# Altium schematic sheet management-i2c.SchDoc
size A3
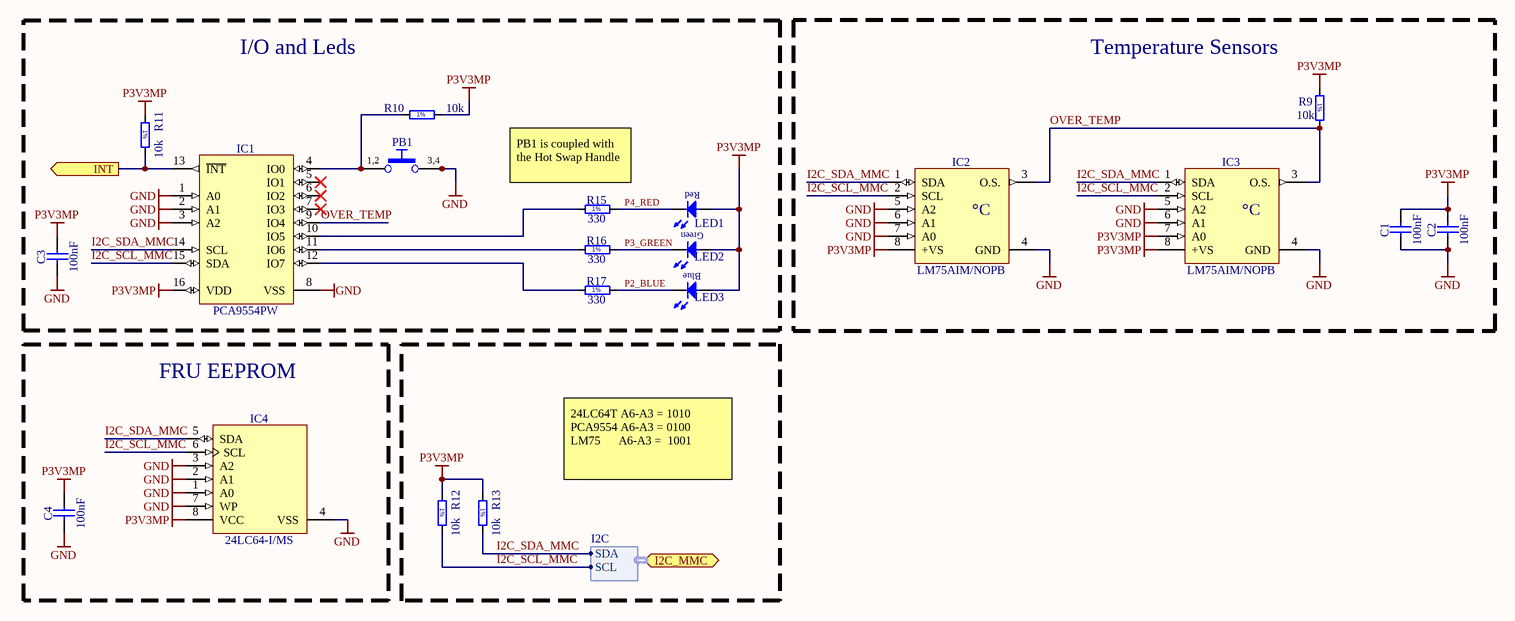
[diagram p0: management-i2c.SchDoc]

## Parts
C1  100nF  [CAPC1005X55N]
C2  100nF  [CAPC1005X55N]
C3  100nF  [CAPC1005X55N]
C4  100nF  [CAPC1005X55N]
IC1  PCA9554PW  [SOP65P640X110-16N]
IC2  LM75AIM/NOPB  [SOIC127P600X175-8N]
IC3  LM75AIM/NOPB  [SOIC127P600X175-8N]
IC4  24LC64-I/MS  [SOP65P490X110-8N]
LED1  Red  [LEDC1608X80N_RED]  (value not drawn)
LED2  Green  [LED_AVAGO_HSME-C120]  (value not drawn)
LED3  Blue  [LED_AVAGO_HSMR-C120]  (value not drawn)
PB1  Push Button  [SW_C&K_HDT0001]  (value not drawn)
R9  10k  [RESC1005X40N]
R10  10k  [RESC1005X40N]
R11  10k  [RESC1005X40N]
R12  10k  [RESC1005X40N]
R13  10k  [RESC1005X40N]
R15  330  [RESC1608X55N]
R16  330  [RESC1608X55N]
R17  330  [RESC1608X55N]

## Blocks framed on the sheet
I/O and Leds: C3 IC1 LED1-LED3 PB1 R10 R11 R15-R17
Temperature Sensors: C1 C2 IC2 IC3 R9
FRU EEPROM: C4 IC4

## Ports
I2C_MMC (bidir, harness I2C), INT (out)

## Harnesses
I2C: SDA, SCL

## Nets
GND: C1.2 C2.2 C3.2 C4.2 IC1.1(A0) IC1.2(A1) IC1.3(A2) IC1.8(VSS) IC2.4(GND) IC2.5(A2) IC2.6(A1) IC2.7(A0) IC3.4(GND) IC3.5(A2) IC3.6(A1) IC4.1(A0) IC4.2(A1) IC4.3(A2) IC4.4(VSS) IC4.7(WP) PB1.3 PB1.4
P3V3MP: C1.1 C2.1 C3.1 C4.1 IC1.16(VDD) IC2.8(+VS) IC3.7(A0) IC3.8(+VS) IC4.8(VCC) LED1.2(A) LED2.2(A) LED3.2(A) R9.1 R10.2 R11.1 R12.1 R13.1
I2C_SCL_MMC: IC1.15(SDA) IC2.2(SCL) IC3.2(SCL) IC4.6(SCL) R12.2 ; port I2C_MMC.SCL
I2C_SDA_MMC: IC1.14(SCL) IC2.1(SDA) IC3.1(SDA) IC4.5(SDA) R13.2 ; port I2C_MMC.SDA
INT: IC1.13(~{INT}) R11.2 ; port INT
OVER_TEMP: IC1.9(IO4) IC2.3(O.S.) IC3.3(O.S.) R9.2
P2_BLUE: LED3.1(C) R17.2
P3_GREEN: LED2.1(C) R16.2
P4_RED: LED1.1(C) R15.2
NetIC1_4: IC1.4(IO0) PB1.1 PB1.2 R10.1
NetIC1_10: IC1.10(IO5) R15.1
NetIC1_11: IC1.11(IO6) R16.1
NetIC1_12: IC1.12(IO7) R17.1

Not connected (* = marked no-connect by the designer): IC1 5(IO1)* 6(IO2)* 7(IO3)*

## Notes on the sheet
- (near R15) PB1 is coupled with the Hot Swap Handle
- 24LC64T A6-A3 = 1010
  PCA9554 A6-A3 = 0100
  LM75      A6-A3 =  1001
- Title:
- Date:
- Project:
- Drawn by:
- Time:
- Revised by:
- Sheet
- of
- Grupo de diagnóstico do feixe -
  DIG - LNLS
- Copyright CNPEM 2020.
  This documentation describes Open Hardware and is licensed under the CERN OHL S v2. You may redistribute and modify this documentation under the terms of the CERN OHL S v2. (https://www.ohwr.org/cernohl). This documentation is distributed WITHOUT ANY EXPRESS OR IMPLIED WARRANTY, INCLUDING OF MERCHANTABILITY, SATISFACTORY QUALITY AND FITNESS FOR A PARTICULAR PURPOSE. Please see the CERN OHL S v2 for applicable conditions.
- File:
- (in symbol LM75AIM/NOPB) °C
- (in symbol R0402_10K_1%_0.0625W_100PPM) 1%
- (in symbol R0603_330R_1%_0.1W_100PPM) 1%
- (in symbol SW_C&K_HDT0001) 1,2; 3,4

## Library data of the parts
C1-C4 = CC0402_100NF_16V_10%_X7R: Non-polarised capacitor; Part Description: SMD Multilayer Chip Ceramic Capacitor; Manufacturer: GENERIC; Manufacturer1 Part Number: 223878715649; Voltage: 16V; TC: X7R; Tolerance: ±10%; Table: Capacitors SMD; Part Number: CC0402_100NF_16V_10%_X7R; Component Kind: Standard; Component Type: Standard; Pin Count: 2; Value: 100nF; Status: Not Recommended; Manufacturer Part Number: CC0402_100NF_16V_10%_X7R; Case: 0402; Mounted: Yes; Socket: No; SMD: Yes; Manufacturer1 Example: PHYCOMP; Manufacturer1 ComponentHeight: 0.55mm; HelpURL: \\cern.ch\dfs\Applications\Altium\Datasheets\CC0402_X7R_PHYCOMP.pdf; Author: CERN DEM JLC; CreateDate: 12/3/2007; LatestRevisionDate: 12/3/2007
IC1 = PCA9554PW: 8-Bit I2C-Bus and SMBus I/O Port with Interrupt; Manufacturer: NXP SEMICONDUCTORS; PressFit: No; Bonding: No; Part Number: PCA9554PW; Component Kind: Standard; Component Type: Standard; Device: PCA9554PW; PackageDescription: SOP, 0.65mm pitch; 16 pin, 4.40mm W X 5.00mm L X 1.10mm H body IPC Medium Density; Part Description: 8-Bit I2C-Bus and SMBus I/O Port with Interrupt; Manufacturer Part Number: PCA9554PW; Pin Count: 16; Case: TSSOP16; Mounted: Yes; Socket: No; SMD: Yes; Sense: No; ComponentHeight: 1.1mm; Author: CERN DEM JLC; HelpURL: \\cern.ch\dfs\Applications\Altium\Datasheets\PCA9554PW.pdf; CreateDate: 04/11/2014; LatestRevisionDate: 04/11/2014
IC2 IC3 = LM75AIM/NOPB: Digital Temperature Sensor and Thermal Watchdog with Two-Wire Interface; Part Description: -25° to +100°C ±2°C Digital Temperature Sensor and Thermal Watchdog with Two-Wire Interface; Manufacturer: TEXAS INSTRUMENTS; PressFit: No; Bonding: No; Part Number: LM75AIM/NOPB; Component Kind: Standard; Component Type: Standard; Device: LM75AIM/NOPB; PackageDescription: SOIC 8, Pitch 1.27mm - Body 4x5mm, IPC Medium Density; Manufacturer Part Number: LM75AIM/NOPB; Pin Count: 8; Case: SOIC8; Mounted: Yes; Socket: No; SMD: Yes; Sense: No; ComponentHeight: 1.75mm; HelpURL: \\cern.ch\dfs\Applications\Altium\Datasheets\LM75AIM-NOPB.pdf; Author: CERN DEM JLC; CreateDate: 15/10/2012; LatestRevisionDate: 15/10/2012
IC4 = 24LC64-I/MS: 64K I2C Serial EEPROM; Part Description: 2.5V-5.5V, 64K (8K x 8-bit) I2C Serial EEPROM; Manufacturer: MICROCHIP TECHNOLOGY; Table: Logic; Part Number: 24LC64-I/MS; Component Kind: Standard; Component Type: Standard; Device: 24LC64-I/MS; PackageDescription: SOP, 0.65mm pitch; 8 pin, 3.00mm W X 3.00mm L X 1.10mm H body, IPC Medium Density; Manufacturer Part Number: 24LC64-I/MS; Pin Count: 8; Case: MSOP8; Mounted: Yes; Socket: No; SMD: Yes; ComponentHeight: 1.1mm; HelpURL: \\cern.ch\dfs\Applications\Altium\Datasheets\24LC64-I-MS.pdf; Author: CERN DEM JLC; CreateDate: 2011-01-24; LatestRevisionDate: 2011-01-24
LED1 = LED_ROHM_SML-311UTT86K: LED Red 1C 2A; Part Description: Low current chip LED SML-311 Serie; Manufacturer: ROHM; PressFit: No; Bonding: No; Part Number: LED_ROHM_SML-311UTT86K; Component Kind: Standard; Component Type: Standard; Color: Red; PackageDescription: Chip Red LED, 2-Leads, Body 1.6x0.8mm, IPC Medium Density; Manufacturer Part Number: SML-311UTT86K; Pin Count: 2; Mounted: Yes; Socket: No; SMD: Yes; Sense: No; ComponentHeight: 0.8mm; HelpURL: \\cern.ch\dfs\Applications\Altium\Datasheets\LED_ROHM_SML-311UTT86K.pdf; Author: CERN DEM JLC; CreateDate: 16/03/2010; LatestRevisionDate: 17/03/2010
LED2 = LED_AVAGO_HSME-C120: LED Green 1C 2A; Part Description: High Performance Right Angle Chip Green LED; Manufacturer: AVAGO TECHNOLOGIES; PressFit: No; Bonding: No; Part Number: LED_AVAGO_HSME-C120; Component Kind: Standard; Component Type: Standard; Color: Green; PackageDescription: Green Chip LED, 2-Leads, Body 1.7x1.1mm, Side Emitting Package; Manufacturer Part Number: HSME-C120; Pin Count: 2; Mounted: Yes; Socket: No; SMD: Yes; Sense: No; ComponentHeight: 0.7mm; HelpURL: \\cern.ch\dfs\Applications\Altium\Datasheets\LED_AVAGO_HSME-C120.pdf; ComponentLink1URL: \\cern.ch\dfs\Applications\Altium\Datasheets\LED_AVAGO_HSME-C110_DESIGN-GUIDE.pdf; ComponentLink1Description: Design Guide; Author: CERN DEM JMW; CreateDate: 22/07/2009; LatestRevisionDate: 20/06/2012
LED3 = LED_AVAGO_HSMR-C120: LED Blue 1C 2A; Part Description: High Performance Right Angle Chip InGaN Blue LED; Manufacturer: AVAGO TECHNOLOGIES; PressFit: No; Bonding: No; Part Number: LED_AVAGO_HSMR-C120; Component Kind: Standard; Component Type: Standard; Color: Blue; Footprint: LED_AVAGO_HSME-C120; PackageDescription: Blue Chip LED, 2-Leads, Body 1.7x1.1mm, Side Emitting Package; Manufacturer Part Number: HSMR-C120; Pin Count: 2; Mounted: Yes; Socket: No; SMD: Yes; Sense: No; ComponentHeight: 0.7mm; HelpURL: \\cern.ch\dfs\Applications\Altium\Datasheets\LED_AVAGO_HSMR-C120.pdf; Author: CERN DEM JLC; CreateDate: 07/07/2014; LatestRevisionDate: 07/07/2014
PB1 = SW_C&K_HDT0001: Push-Button Switch SPDT; Part Description: 5VDC 1mA SPST-NO Micro Mini Surface Surface Mount Detect Push-Button Switch, HDT Serie; Manufacturer: C&K; Table: Switches; Part Number: SW_C&K_HDT0001; Component Kind: Standard; Component Type: Standard; Pin Count: 4; PackageDescription: Body 3.5x2.8mm, Micro Mini Surface Mount Detect Switches, HDT Serie; Family: Push Button; Mounted: Yes; Socket: No; SMD: Yes; Status: None; Manufacturer Part Number: HDT0001; ComponentHeight: 3.35mm; HelpURL: \\cern.ch\dfs\Applications\Altium\Datasheets\SW_C&K_HDT0001.pdf; Author: CERN DEM JLC; CreateDate: 2012-08-15; LatestRevisionDate: 2012-08-15
R9-R13 = R0402_10K_1%_0.0625W_100PPM: Resistor - 1%; Part Description: General Purpose Thick Film Chip Resistor; Manufacturer: GENERIC; Manufacturer1 Part Number: 232270671003L; TC: ±100ppm/°C; Table: Resistors SMD; Part Number: R0402_10K_1%_0.0625W_100PPM; Component Kind: Standard; Component Type: Standard; Pin Count: 2; Value: 10k; Status: Not recommended; Power: 0.0625W; Tolerance: ±1%; Manufacturer Part Number: R0402_10K_1%_0.0625W_100PPM; Case: 0402; Mounted: Yes; Socket: No; SMD: Yes; Manufacturer1 Example: YAGEO PHYCOMP; Manufacturer1 ComponentHeight: 0.4mm; HelpURL: \\cern.ch\dfs\Applications\Altium\Datasheets\R0402_Phycomp_RC0402.pdf; Author: CERN DEM JLC; CreateDate: 2007-12-03; LatestRevisionDate: 2012-10-17
R15-R17 = R0603_330R_1%_0.1W_100PPM: Resistor - 1%; Part Description: General Purpose Thick Film Chip Resistor; Manufacturer: GENERIC; Manufacturer1 Part Number: NRC06F3300TRF; Power: 0.1W; TC: ±100ppm/°C; Table: Resistors SMD; Part Number: R0603_330R_1%_0.1W_100PPM; Component Kind: Standard; Component Type: Standard; Pin Count: 2; Value: 330; Status: Preferred; Tolerance: ±1%; Manufacturer Part Number: R0603_330R_1%_0.1W_100PPM; Case: 0603; Mounted: Yes; Socket: No; SMD: Yes; Manufacturer1 Example: NIC COMPONENT; Manufacturer1 ComponentHeight: 0.55mm; HelpURL: \\cern.ch\dfs\Applications\Altium\Datasheets\R0603_NIC_NRC.pdf; Author: CERN DEM JLC; CreateDate: 2007-12-03; LatestRevisionDate: 2008-03-13